# EAGLE design gear_indicator_v1_0 (EAGLE 6.0)
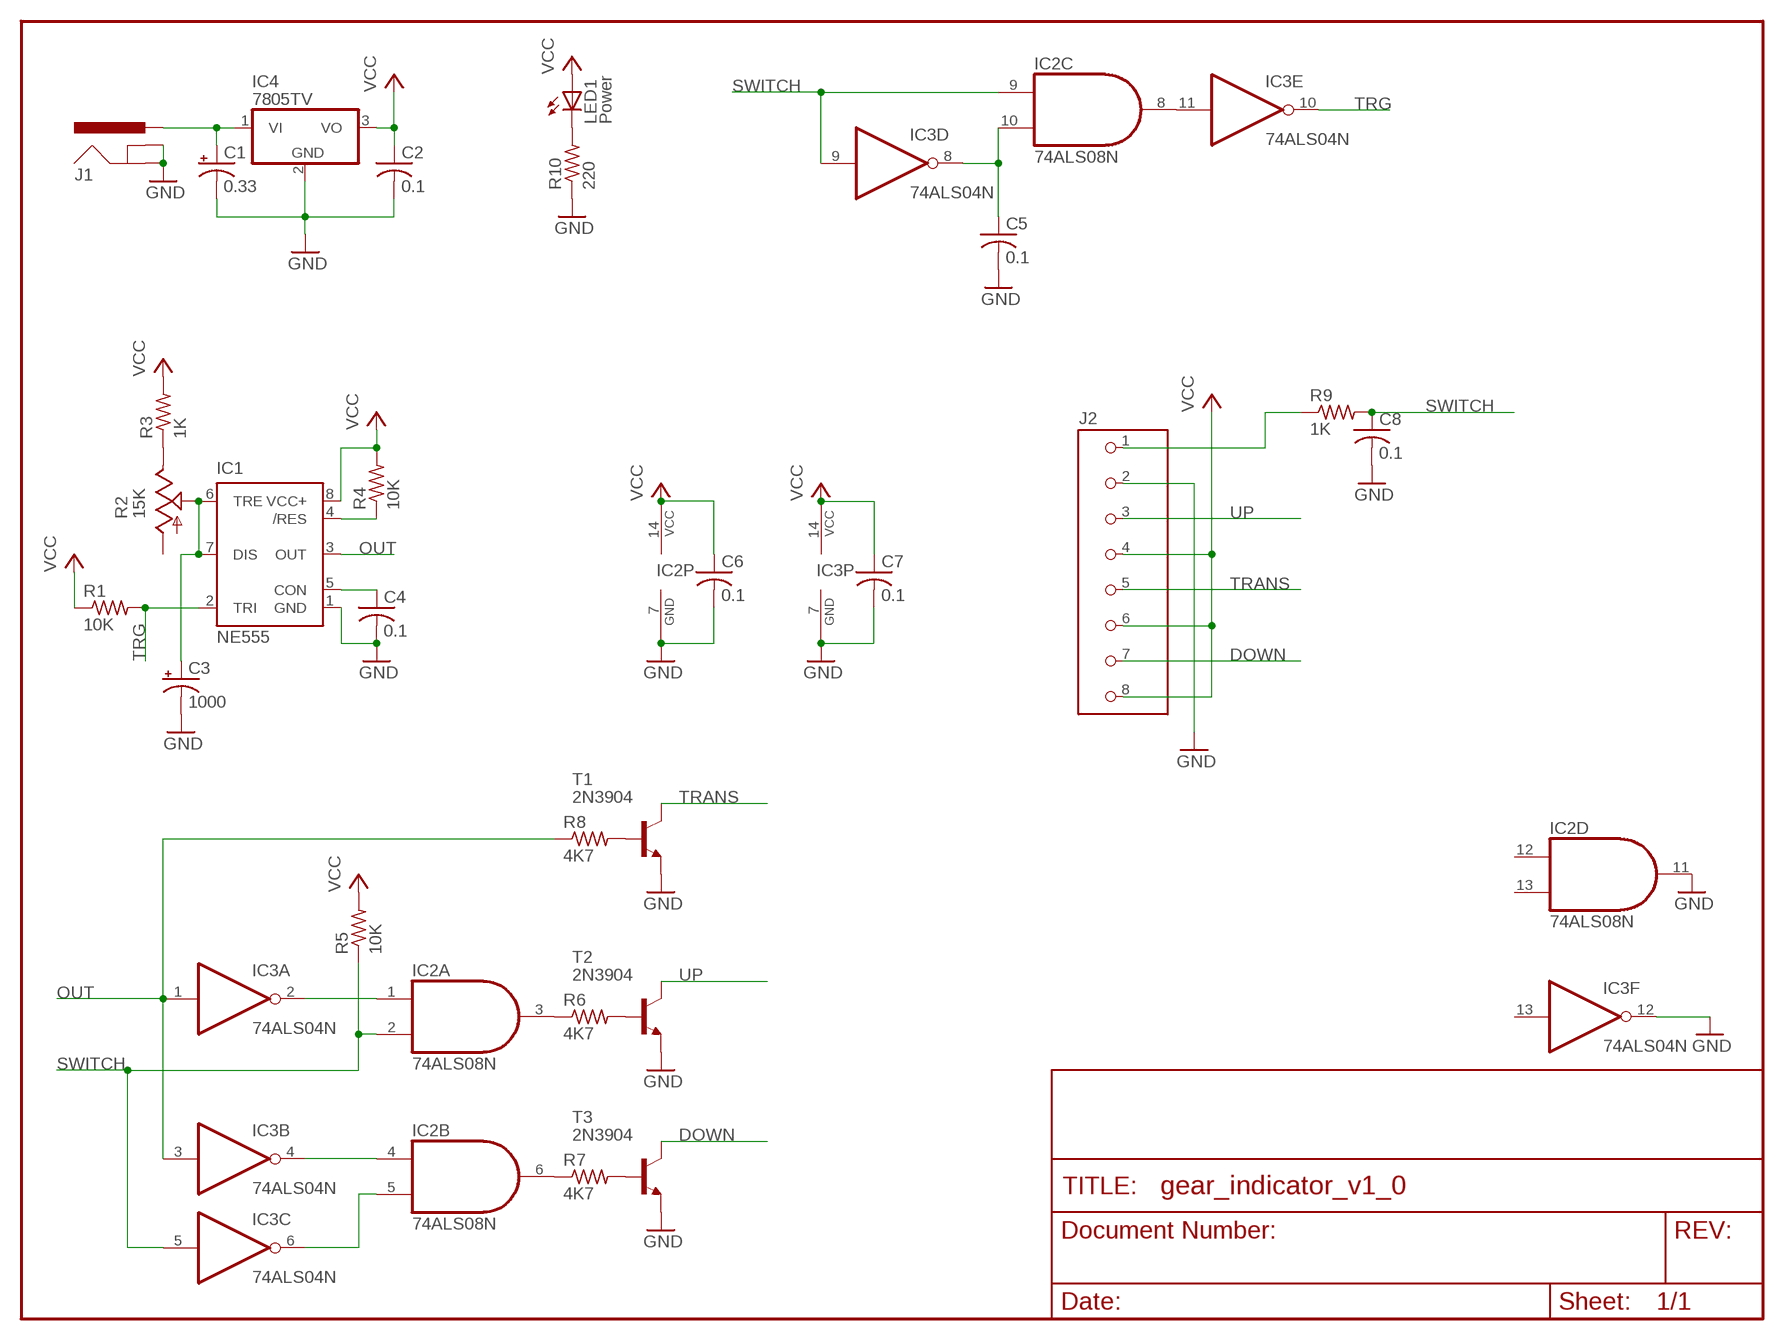
[diagram p0: schematic, sheet 1]

## Parts
C1  0.33  CPOL-USE2.5-6  [E2,5-6]
C2  0.1  C-US025-025X050  [C025-025X050]
C3  1000  CPOL-USE3.5-10  [E3,5-10]
C4  0.1  C-US025-025X050  [C025-025X050]
C5  0.1  C-US025-025X050  [C025-025X050]
C6  0.1  C-US025-025X050  [C025-025X050]
C7  0.1  C-US025-025X050  [C025-025X050]
C8  0.1  C-US025-025X050  [C025-025X050]
IC1  NE555  [DIL-08]
IC2  74ALS08N  [DIL14]
IC3  74ALS04N  [DIL14]
IC4  7805TV  [TO220V]
J1  POWER_JACKPTH  [POWER_JACK_PTH]
J2  TERMBLOCKX8  [TERMBLOCKX8]
LED1  Power  LED3MM  [LED-3MM]
R1  10K  R-US_0207/7  [0207/7]
R2  15K  TRIM_US-B25P  [B25P]
R3  1K  R-US_0207/7  [0207/7]
R4  10K  R-US_0207/7  [0207/7]
R5  10K  R-US_0207/7  [0207/7]
R6  4K7  R-US_0207/7  [0207/7]
R7  4K7  R-US_0207/7  [0207/7]
R8  4K7  R-US_0207/7  [0207/7]
R9  1K  R-US_0207/7  [0207/7]
R10  220  R-US_0207/7  [0207/7]
T1  2N3904  [TO92]
T2  2N3904  [TO92]
T3  2N3904  [TO92]

## Nets
DOWN: J2.7 T3.1(C)
GND: C1.- C2.2 C3.- C4.2 C5.2 C6.2 C7.2 C8.2 IC1.1(GND) IC2.7(P:GND) IC2.11(D:O) IC3.7(P:GND) IC3.12(F:O) IC4.2(GND) J1.GND J1.GNDBREAK J2.2 R10.1 T1.3(E) T2.3(E) T3.3(E)
N$1: R2.E R3.1
N$2: C3.+ IC1.6(TRE) IC1.7(DIS) R2.S
N$3: IC1.4(/RES) R4.1
N$4: C4.1 IC1.5(CON)
N$5: IC2.1(A:I0) IC3.2(A:O)
N$6: IC2.4(B:I0) IC3.4(B:O)
N$7: IC2.5(B:I1) IC3.6(C:O)
N$8: IC2.3(A:O) R6.1
N$9: IC2.6(B:O) R7.1
N$10: R8.2 T1.2(B)
N$11: R6.2 T2.2(B)
N$12: C1.+ IC4.1(VI) J1.PWR
N$13: R7.2 T3.2(B)
N$14: IC2.8(C:O) IC3.11(E:I)
N$15: C5.1 IC2.10(C:I1) IC3.8(D:O)
N$16: LED1.K(C) R10.2
N$17: J2.1 R9.1
OUT: IC1.3(OUT) IC3.1(A:I) IC3.3(B:I) R8.1
SWITCH: C8.1 IC2.2(A:I1) IC2.9(C:I0) IC3.5(C:I) IC3.9(D:I) R5.1 R9.2
TRANS: J2.5 T1.1(C)
TRG: IC1.2(TRI) IC3.10(E:O) R1.2
UP: J2.3 T2.1(C)
VCC: C2.1 C6.1 C7.1 IC1.8(VCC+) IC2.14(P:VCC) IC3.14(P:VCC) IC4.3(VO) J2.4 J2.6 J2.8 LED1.A R1.1 R3.2 R4.2 R5.2
Unconnected: IC2.12(D:I0) IC2.13(D:I1) IC3.13(F:I) R2.A

## Library data of the parts
C1 C3 = rcl:CPOL-US: POLARIZED CAPACITOR, American symbol
C2 C4-C8 = resistor:C-US: CAPACITOR, American symbol
IC1 = st-microelectronics:NE555: General purpose bipolar Timer
IC2 = 74xx-us:74*08: Quad 2-input AND gate
IC3 = 74xx-us:74*04: Hex INVERTER
IC4 = linear:78*: Positive VOLTAGE REGULATOR Source: http://cache.national.com/ds/LM/LM78L05.pdf http://www.fairchildsemi.com/ds/LM/LM7805.pdf
J1 = SparkFun:POWER_JACK: Power Jack This is the standard 5.5mm barrel jack for power. The PTH is the most common, proven, reliable, footprint. All others are experimental. The Slot footprint only works if the mill layer is transmitted to the PCB fab house so be warned. Spark Fun Electronics SKU : PRT-00119. Mating wall wart : TOL-00298 (and others)
J2 = wlr:TERMBLOCKX8
LED1 = dp_devices:LED
R1 R3-R10 = resistor:R-US_: RESISTOR, American symbol
R2 = pot:TRIM_US-: POTENTIOMETER
T1-T3 = transistor:2N3904: NPN TRANSISTOR

## Board
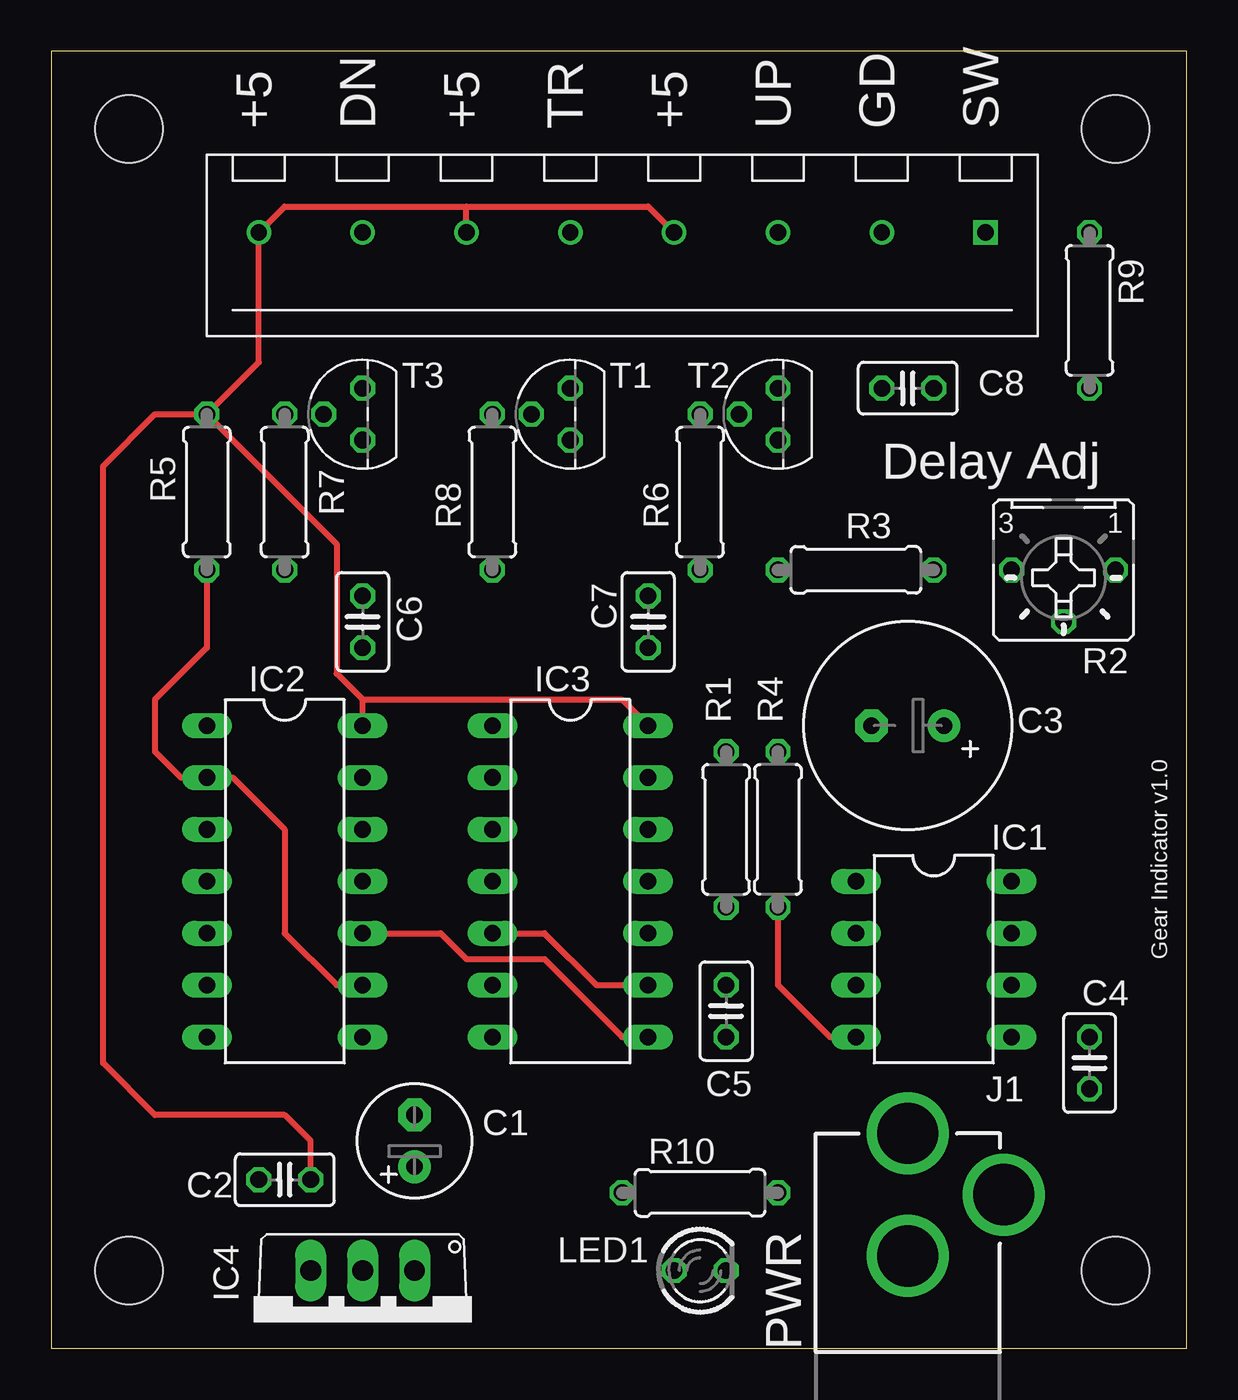
[diagram p1: board, top side]
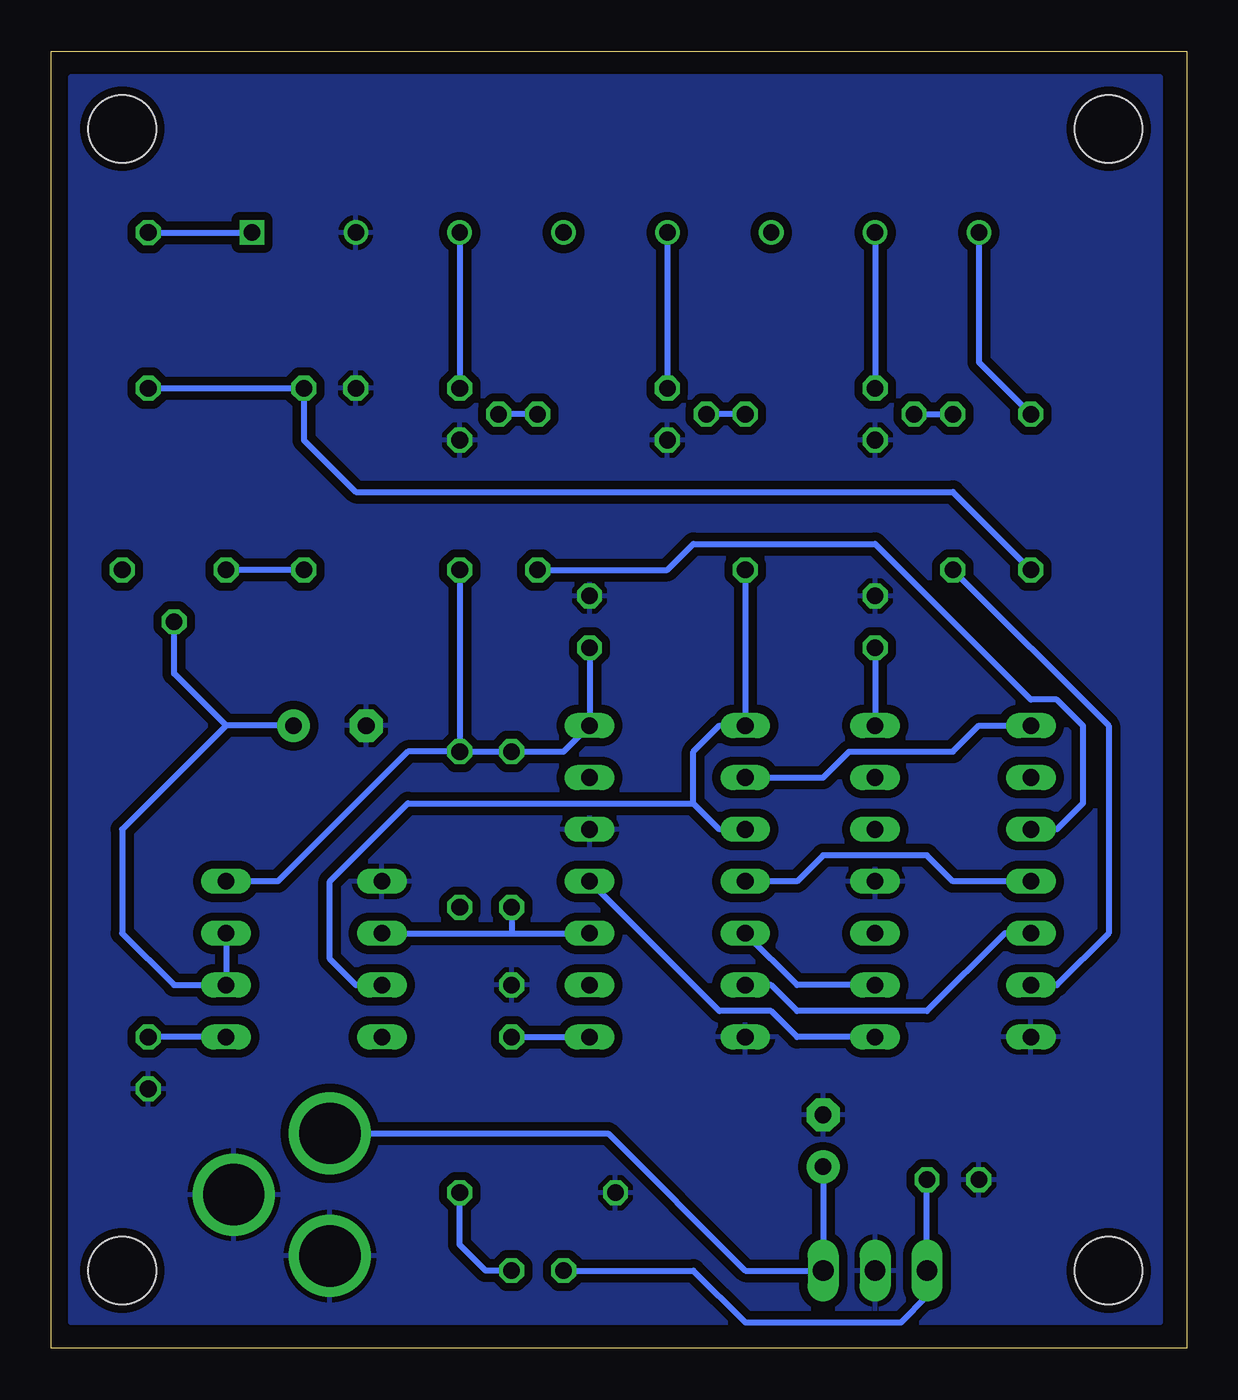
[diagram p2: board, bottom side, seen from below]

Size 55.55 x 63.49 mm. Coordinates in mm from the lower left corner, seen from the top.
Outline: 0,0 55.55,0 55.55,63.49 0,63.49 0,0
Copper layers (1*16): Top 0.0356mm / dielectric 1.5011mm / Bottom 0.0356mm
Design rules: minimum track width 6mil, minimum drill 13mil, track to track 6mil, track to pad 6mil, pad to pad 6mil, via to via 6mil, smd to smd 6mil, copper to edge 15mil, drill to drill 6mil, minimum pad ring 7mil, minimum via ring 7mil, stop-mask expansion 4mil, vias tented up to drill 0mil, thermal gap 10mil

### Footprints (pad centres in the part's own frame; a part is rotated, then mirrored left to right if it is on the bottom)
E2,5-6 = drill 0.813 pad 1.6: + -1.27,0 | drill 0.813 pad 1.6 octagon: - 1.27,0
C025-025X050 = drill 0.813 octagon: 1 -1.27,0; 2 1.27,0
E3,5-10 = drill 0.813 pad 1.6: + -1.778,0 | drill 0.813 pad 1.6 octagon: - 1.778,0
DIL-08 = drill 0.813 long: 1 -3.81,-3.81; 2 -1.27,-3.81; 3 1.27,-3.81; 4 3.81,-3.81; 5 3.81,3.81; 6 1.27,3.81; 7 -1.27,3.81; 8 -3.81,3.81
DIL14 = drill 0.813 long: 1 -7.62,-3.81; 2 -5.08,-3.81; 3 -2.54,-3.81; 4 0,-3.81; 5 2.54,-3.81; 6 5.08,-3.81; 7 7.62,-3.81; 8 7.62,3.81; 9 5.08,3.81; 10 2.54,3.81; 11 0,3.81; 12 -2.54,3.81; 13 -5.08,3.81; 14 -7.62,3.81
TO220V = drill 1.016 long: 1 -2.54,-2.54; 2 0,-2.54; 3 2.54,-2.54
POWER_JACK_PTH = drill 2.997: GND 0,7.7; GNDBREAK 4.7,10.7; PWR 0,13.7
TERMBLOCKX8 = drill 0.8 square: 1 0,17.78 | drill 0.8: 2 0,12.7; 3 0,7.62; 4 0,2.54; 5 0,-2.54; 6 0,-7.62; 7 0,-12.7; 8 0,-17.78
LED-3MM = drill 0.813 octagon: A -1.27,0; K 1.27,0
0207/7 = drill 0.813 octagon: 1 -3.81,0; 2 3.81,0
B25P = drill 0.813 octagon: A -2.54,0; E 2.54,0; S 0,2.54
TO92 = drill 0.813 octagon: 1 1.27,0; 2 0,1.905; 3 -1.27,0
STAND-OFF = hole 3.302: 0,0

### Placement (x,y rotation side)
C1  17.78,10.16 90 top
C2  11.43,8.26 180 top
C3  41.91,30.48 180 top
C4  50.8,13.97 270 top
C5  33.02,16.51 90 top
C6  15.24,35.56 90 top
C7  29.21,35.56 90 top
C8  41.91,46.99 180 top
IC1  43.18,19.05 270 top
IC2  11.43,22.86 270 top
IC3  25.4,22.86 270 top
IC4  15.24,1.27 180 top
J1  41.91,-3.17 0 top
J2  27.94,54.61 270 top
LED1  31.75,3.81 0 top
R1  33.02,25.4 270 top
R2  49.53,38.1 180 top
R3  39.37,38.1 180 top
R4  35.56,25.4 90 top
R5  7.62,41.91 90 top
R6  31.75,41.91 90 top
R7  11.43,41.91 90 top
R8  21.59,41.91 90 top
R9  50.8,50.8 270 top
R10  31.75,7.62 0 top
T1  25.4,45.72 90 top
T2  35.56,45.72 90 top
T3  15.24,45.72 90 top
U$1  [STAND-OFF]  52.07,3.81 0 top
U$2  [STAND-OFF]  3.81,3.81 0 top
U$3  [STAND-OFF]  3.81,59.69 0 top
U$4  [STAND-OFF]  52.07,59.69 0 top

### Tracks (layer width: path | path; a pad name or v marks a point on that pad's centre or on a via)
DOWN
  Bottom 0.305: J2.7 T3.1
GND
  pour Bottom (isolate 0.406): 1.27,62.23 54.61,62.23 54.61,1.27 1.27,1.27
N$1
  Bottom 0.305: R3.1 R2.E
N$2
  Bottom 0.305: C3.+ 46.99,30.48 | 46.99,30.48 49.53,33.02 R2.S | 46.99,30.48 52.07,25.4 52.07,20.32 49.53,17.78 IC1.6 IC1.7
N$3
  Top 0.305: R4.1 35.56,17.78 38.1,15.24 IC1.4
N$4
  Bottom 0.305: IC1.5 C4.1
N$5
  Bottom 0.305: IC3.2 17.78,27.94 16.51,29.21 11.43,29.21 10.16,30.48 IC2.1
N$6
  Bottom 0.305: IC2.4 11.43,22.86 12.7,24.13 17.78,24.13 19.05,22.86 IC3.4
N$7
  Bottom 0.305: IC2.5 8.89,20.32 12.7,16.51 19.05,16.51 20.32,17.78 IC3.6
N$8
  Bottom 0.305: R6.1 25.4,38.1 24.13,39.37 15.24,39.37 7.62,31.75 6.35,31.75 5.08,30.48 5.08,26.67 6.35,25.4 IC2.3
N$9
  Bottom 0.305: R7.1 3.81,30.48 3.81,20.32 6.35,17.78 IC2.6
N$10
  Bottom 0.305: R8.2 T1.2
N$11
  Bottom 0.305: R6.2 T2.2
N$12
  Bottom 0.305: J1.PWR 28.3,10.53 21.59,3.81 IC4.1 C1.+
N$13
  Bottom 0.305: T3.2 R7.2
N$14
  Bottom 0.305: IC2.8 19.05,15.24 20.32,16.51 22.86,16.51 IC3.11
N$15
  Top 0.305: IC2.10 19.05,20.32 20.32,19.05 24.13,19.05 27.94,15.24 IC3.8
  Bottom 0.305: C5.1 IC3.8
N$16
  Bottom 0.305: LED1.K 34.29,3.81 35.56,5.08 R10.2
N$17
  Bottom 0.305: R9.1 J2.1
OUT
  Bottom 0.305: IC3.3 22.86,25.4 24.13,26.67 | 24.13,26.67 24.13,29.21 22.86,30.48 IC3.1 R8.1 | IC1.3 40.64,17.78 41.91,19.05 41.91,22.86 38.1,26.67 24.13,26.67
SWITCH
  Top 0.305: IC3.5 24.13,20.32 26.67,17.78 IC3.9 | R5.1 7.62,34.29 5.08,31.75 5.08,29.21 6.35,27.94 IC2.2 8.89,27.94 11.43,25.4 11.43,20.32 13.97,17.78 IC2.9
  Bottom 0.305: IC2.9 19.05,17.78 IC3.5 | R9.2 C8.1 43.18,44.45 40.64,41.91 11.43,41.91 R5.1
TRANS
  Bottom 0.305: J2.5 T1.1
TRG
  Bottom 0.305: 33.02,20.32 IC3.10 | R1.2 33.02,20.32 | IC1.2 33.02,20.32
UP
  Bottom 0.305: J2.3 T2.1
VCC
  Top 0.305: C2.1 12.7,10.16 11.43,11.43 5.08,11.43 2.54,13.97 2.54,43.18 5.08,45.72 R5.2 | R5.2 10.16,48.26 J2.8 11.43,55.88 20.32,55.88 | 20.32,55.88 29.21,55.88 J2.4 | J2.6 20.32,55.88 | R5.2 13.97,39.37 13.97,33.02 15.24,31.75 | 15.24,31.75 27.94,31.75 IC3.14 | IC2.14 15.24,31.75
  Bottom 0.305: C2.1 IC4.3 12.7,2.54 13.97,1.27 21.59,1.27 24.13,3.81 LED1.A | R4.2 R1.1 30.48,29.21 IC3.14 C7.1 | R3.2 R4.2 | C6.1 IC2.14 | J2.8 10.16,48.26 R5.2 | R4.2 38.1,29.21 44.45,22.86 IC1.8

### Text on the board
tPlace: +5 | DN | +5 | TR | +5 | UP | GD | SW | Delay Adj | Gear Indicator v1.0 | PWR